# EAGLE design uJDM (EAGLE 5.10)
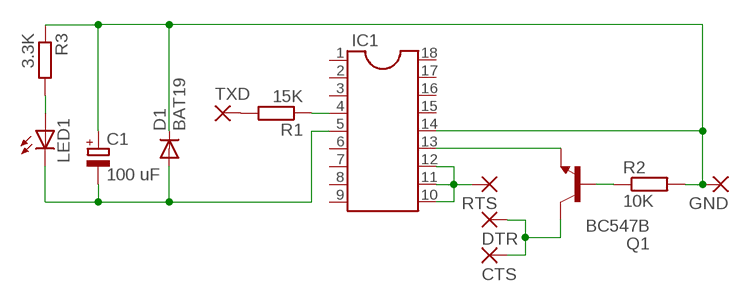
[diagram p0: schematic, sheet 1]

## Parts
C1  100 uF  CPOL-EUE2.5-7  [E2,5-7]
CTS  2,54/1,0  [2,54/1,0]
D1  BAT19  BAS15  [DO34-7]
DTR  2,54/1,0  [2,54/1,0]
GND  2,54/1,0  [2,54/1,0]
IC1  DIL18S  [SOCKET-18]
LED1  LED5MM  [LED5MM]
Q1  BC547B  [TO92]
R1  15K  R-EU_0204/7  [0204/7]
R2  10K  R-EU_0204/7  [0204/7]
R3  3.3K  R-EU_0204/7  [0204/7]
RTS  2,54/1,0  [2,54/1,0]
TXD  2,54/1,0  [2,54/1,0]

## Nets
MCLR: IC1.4 R1.1
N$1: R1.2 TXD.1(P)
N$2: IC1.10 IC1.11 IC1.12 RTS.1(P)
N$3: IC1.13 Q1.1(E)
N$4: Q1.2(B) R2.1
N$6: C1.- D1.A IC1.5 LED1.K(C)
N$7: CTS.1(P) DTR.1(P) Q1.3(C)
N$8: LED1.A R3.2
N$9: C1.+ D1.C GND.1(P) IC1.14 R2.2 R3.1
Unconnected: IC1.1 IC1.2 IC1.3 IC1.6 IC1.7 IC1.8 IC1.9 IC1.15 IC1.16 IC1.17 IC1.18

## Library data of the parts
C1 = resistor:CPOL-EU: POLARIZED CAPACITOR, European symbol
CTS DTR GND RTS TXD = wirepad:2,54/1,0: THROUGH-HOLE PAD
D1 = diode:BAS15: DIODE high speed
IC1 = ic-package:DIL18: Dual In Line / Socket
LED1 = led:LED: LED OSRAM: - CHIPLED LG R971, LG N971, LY N971, LG Q971, LY Q971, LO R971, LY R971 LH N974, LH R974 LS Q976, LO Q976, LY Q976 LO Q996 - Hyper CHIPLED LW Q18S LB Q993, LB Q99A, LB R99A - SideLED LS A670, LO A670, LY A670, LG A670, LP A670 LB A673, LV A673, LT A673, LW A673 LH A674 LY A675 LS A676, LA A676, LO A676, LY A676, LW A676 LS A679, LY A679, LG A679 - Hyper Micro SIDELED® LS Y876, LA Y876, LO Y876, LY Y876 LT Y87S - SmartLED LW L88C, LW L88S LB L89C, LB L89S, LG L890 LS L89K, LO L89K, LY L89K LS L896, LA L896, LO L896, LY L896 - TOPLED LS T670, LO T670, LY T670, LG T670, LP T670 LSG T670, LSP T670, LSY T670, LOP T670, LYG T670 LG T671, LOG T671, LSG T671 LB T673, LV T673, LT T673, LW T673 LH T674 LS T676, LA T676, LO T676, LY T676, LB T676, LH T676, LSB T676, LW T676 LB T67C, LV T67C, LT T67C, LS T67K, LO T67K, LY T67K, LW E67C LS E67B, LA E67B, LO E67B, LY E67B, LB E67C, LV E67C, LT E67C LW T67C LS T679, LY T679, LG T679 LS T770, LO T770, LY T770, LG T770, LP T770 LB T773, LV T773, LT T773, LW T773 LH T774 LS E675, LA E675, LY E675, LS T675 LS T776, LA T776, LO T776, LY T776, LB T776 LHGB T686 LT T68C, LB T68C - Hyper Mini TOPLED® LB M676 - Mini TOPLED Santana® LG M470 LS M47K, LO M47K, LY M47K Source: http://www.osram.convergy.de LUXEON: - LUMILED® LXK2-PW12-R00, LXK2-PW12-S00, LXK2-PW14-U00, LXK2-PW14-V00 LXK2-PM12-R00, LXK2-PM12-S00, LXK2-PM14-U00 LXK2-PE12-Q00, LXK2-PE12-R00, LXK2-PE12-S00, LXK2-PE14-T00, LXK2-PE14-U00 LXK2-PB12-K00, LXK2-PB12-L00, LXK2-PB12-M00, LXK2-PB14-N00, LXK2-PB14-P00, LXK2-PB14-Q00 LXK2-PR12-L00, LXK2-PR12-M00, LXK2-PR14-Q00, LXK2-PR14-R00 LXK2-PD12-Q00, LXK2-PD12-R00, LXK2-PD12-S00 LXK2-PH12-R00, LXK2-PH12-S00 LXK2-PL12-P00, LXK2-PL12-Q00, LXK2-PL12-R00 Source: www.luxeon.com KINGBRIGHT: KA-3528ASYC Source: www.kingbright.com
Q1 = transistor-npn:BC547*: NPN Transistor
R1-R3 = resistor:R-EU_: RESISTOR, European symbol

## Board
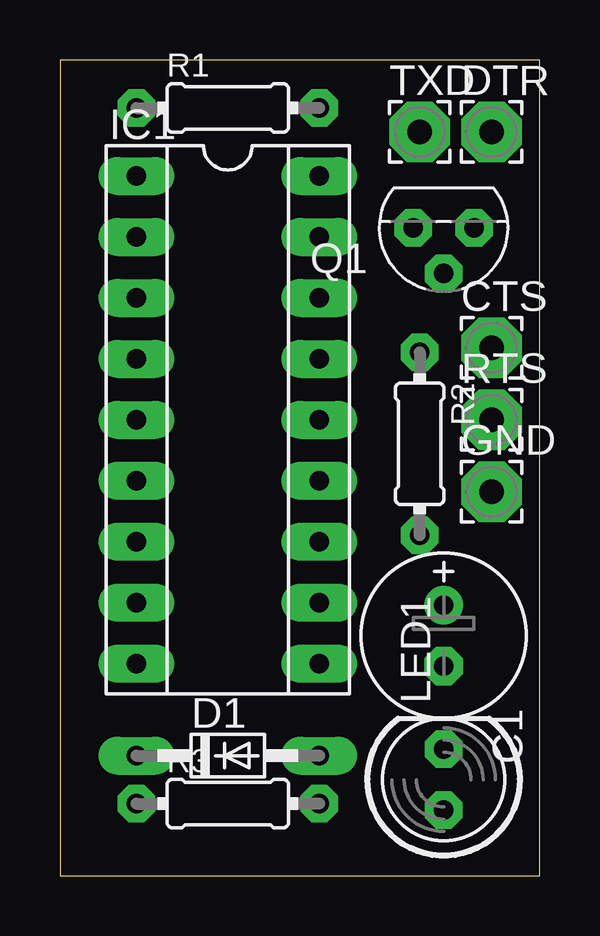
[diagram p1: board, top side]
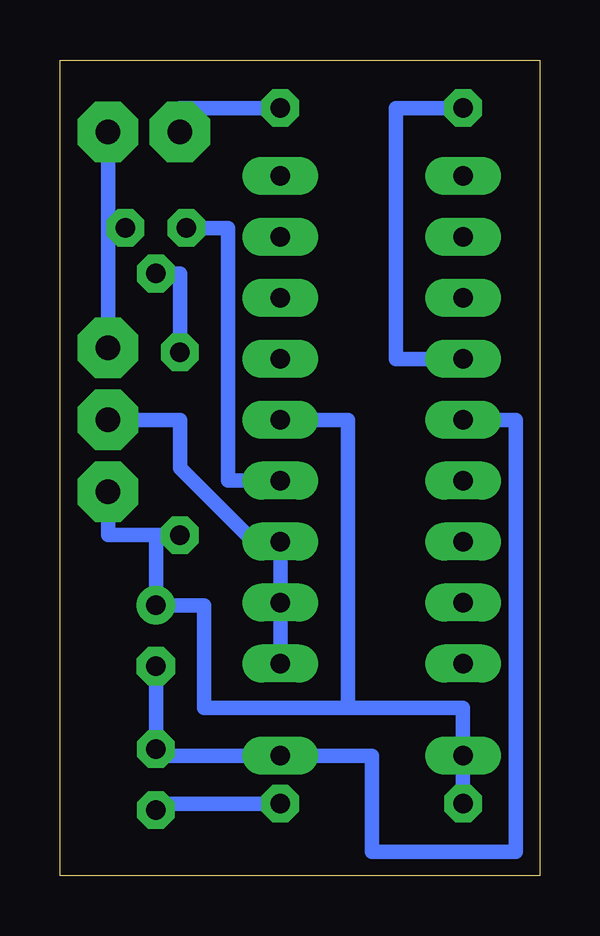
[diagram p2: board, bottom side, seen from below]

Size 20 x 34 mm. Coordinates in mm from the lower left corner, seen from the top.
Outline: 0,0 20,0 20,34 0,34 0,0
Copper layers (1*16): Top 0.035mm / dielectric 1.5mm / Bottom 0.035mm
Design rules "default *": minimum track width 10mil, minimum drill 24mil, track to track 8mil, track to pad 8mil, pad to pad 8mil, via to via 8mil, smd to smd 8mil, copper to edge 40mil, drill to drill 8mil, minimum pad ring 15mil, minimum via ring 8mil, stop-mask expansion 4mil, vias tented up to drill 0mil, thermal gap 10mil

### Footprints (pad centres in the part's own frame; a part is rotated, then mirrored left to right if it is on the bottom)
E2,5-7 = drill 0.813 pad 1.6 round: + -1.27,0 | drill 0.813 pad 1.6 octagon: - 1.27,0
2,54/1,0 = drill 1.016 pad 2.54 octagon: 1 0,0
DO34-7 = drill 0.813 long: A 3.81,0; C -3.81,0
SOCKET-18 = drill 0.813 long: 1 -10.16,-3.81; 2 -7.62,-3.81; 3 -5.08,-3.81; 4 -2.54,-3.81; 5 0,-3.81; 6 2.54,-3.81; 7 5.08,-3.81; 8 7.62,-3.81; 9 10.16,-3.81; 10 10.16,3.81; 11 7.62,3.81; 12 5.08,3.81; 13 2.54,3.81; 14 0,3.81; 15 -2.54,3.81; 16 -5.08,3.81; 17 -7.62,3.81; 18 -10.16,3.81
LED5MM = drill 0.813 octagon: A -1.27,0; K 1.27,0
TO92 = drill 0.813 octagon: 1 1.27,0; 2 0,1.905; 3 -1.27,0
0204/7 = drill 0.813 octagon: 1 -3.81,0; 2 3.81,0

### Placement (x,y rotation side)
C1  16,10 270 top
CTS  18,22 0 top
D1  7,5 0 top
DTR  18,31 0 top
GND  18,16 0 top
IC1  7,19 270 top
LED1  16,4 90 top
Q1  16,27 180 top
R1  7,32 0 top
R2  15,18 270 top
R3  7,3 0 top
RTS  18,19 0 top
TXD  15,31 0 top

### Tracks (layer width: path | path; a pad name or v marks a point on that pad's centre or on a via)
MCLR
  Bottom 0.61: R1.1 6,32 6,21.54 IC1.4
N$1
  Bottom 0.61: TXD.1 15,32 R1.2
N$2
  Bottom 0.61: IC1.10 IC1.11 IC1.12 12,14 15,17 15,19 RTS.1
N$3
  Bottom 0.61: Q1.1 13,27 13,16.46 IC1.13
N$4
  Bottom 0.61: Q1.2 15,25.09 R2.1
N$6
  Bottom 0.61: IC1.5 1,19 1,1 7,1 7,5 D1.A 16,5 LED1.K C1.-
N$7
  Bottom 0.61: CTS.1 18,27 | 18,27 Q1.3 | 18,27 DTR.1
N$8
  Bottom 0.61: R3.2 16,3 LED1.A
N$9
  Bottom 0.61: R3.1 D1.C 3.19,7 8,7 | GND.1 18,14.19 R2.2 16,14.19 C1.+ 14,11.27 14,7 8,7 | IC1.14 8,19 8,7